# Altium schematic sheet ETH_CAN_Sheet1.SchDoc
size A2
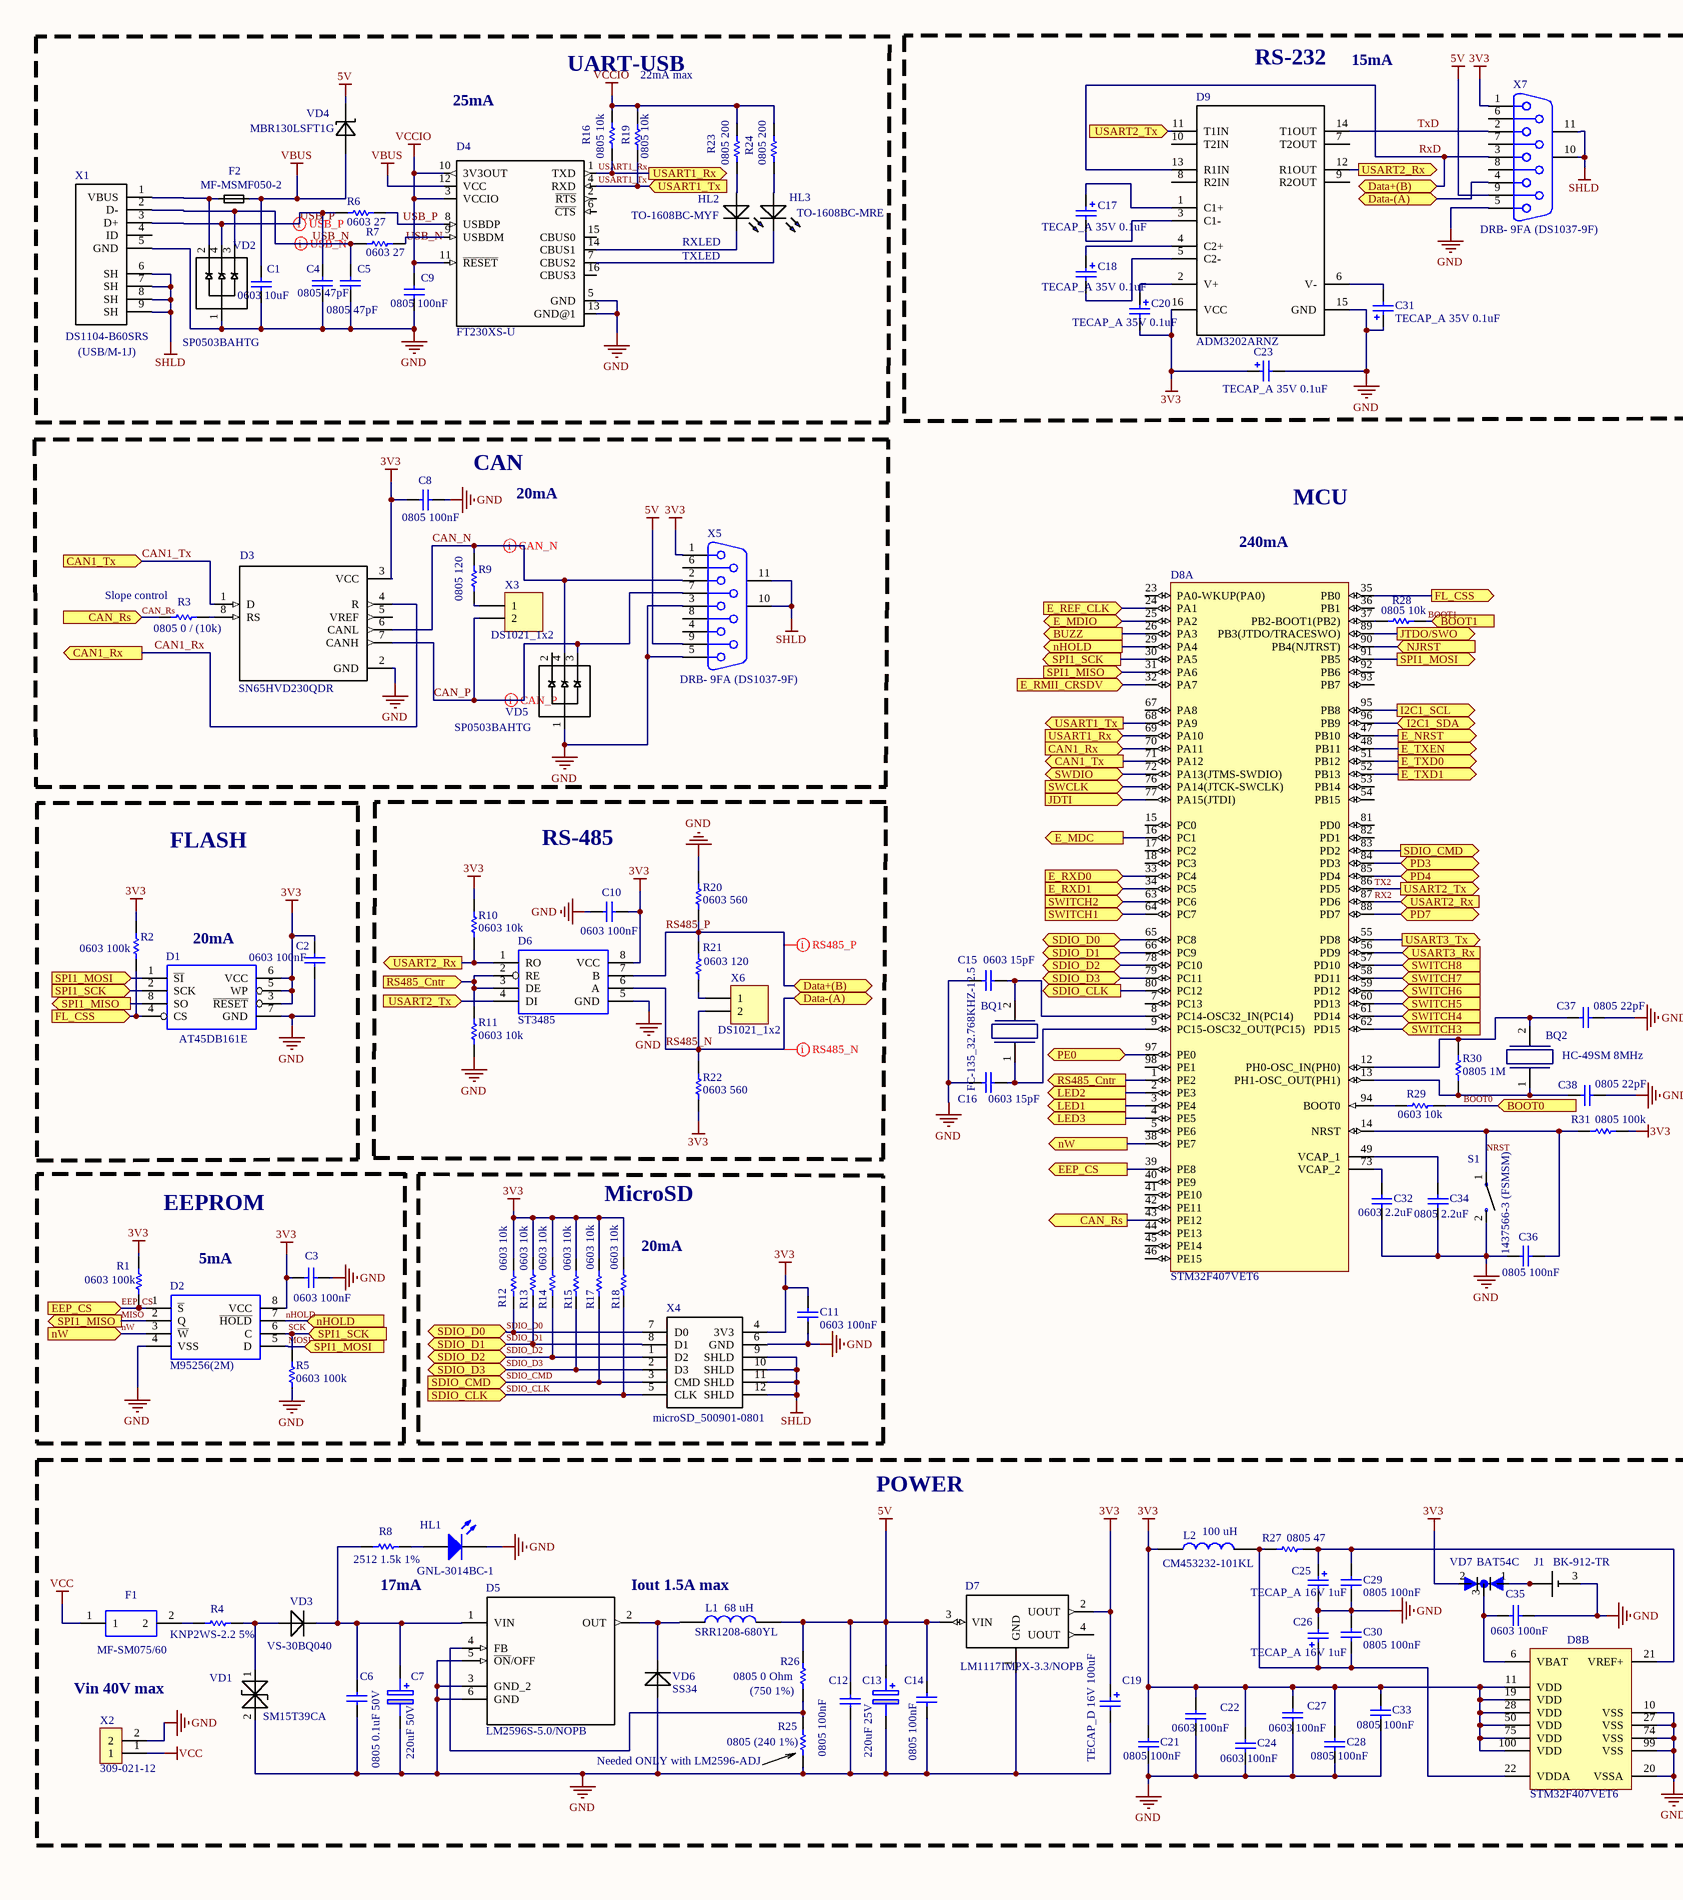
[diagram p0: ETH_CAN_Sheet1.SchDoc, left]
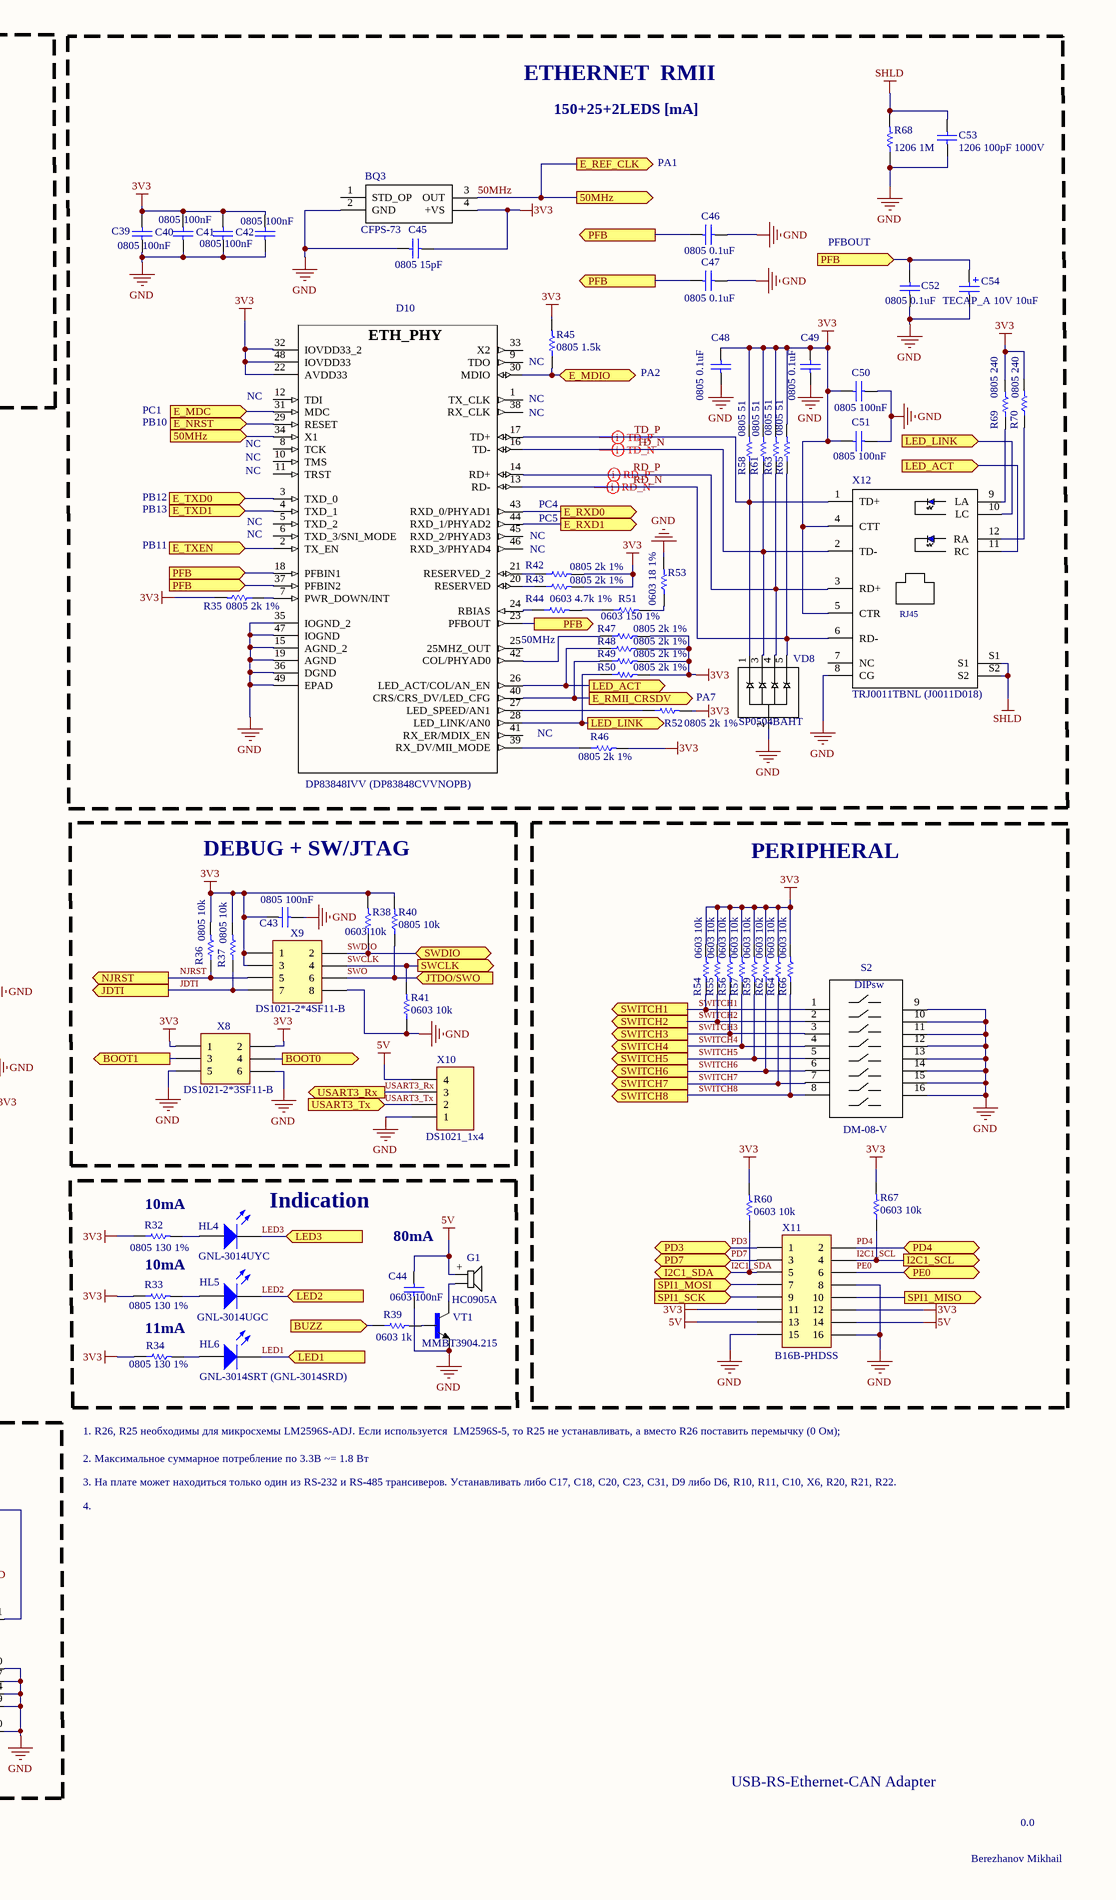
[diagram p1: ETH_CAN_Sheet1.SchDoc, right]

## Parts
BQ1  FC-135_32.768KHZ-12.5  [FC-135]
BQ2  HC-49SM 8MHz  [HC49SM]
BQ3  CFPS-73  [CFPS-73]
C1  0603 10uF  [C_SMD0603]
C2  0603 100nF  [C_SMD0603]
C3  0603 100nF  [C_SMD0603]
C4  0805 47pF  [C_SMD0805]
C5  0805 47pF  [C_SMD0805]
C6  0805 0.1uF 50V  [C_SMD0805]
C7  220uF 50V  [SMD_ELC_CAP]
C8  0805 100nF  [C_SMD0805]
C9  0805 100nF  [C_SMD0805]
C10  0603 100nF  [C_SMD0603]
C11  0603 100nF  [C_SMD0603]
C12  0805 100nF  [C_SMD0805]
C13  220uF 25V  [SMD_ELC_CAP]
C14  0805 100nF  [C_SMD0805]
C15  0603 15pF  [C_SMD0603]
C16  0603 15pF  [C_SMD0603]
C17  TECAP_A 35V 0.1uF  [TECAP_A]
C18  TECAP_A 35V 0.1uF  [TECAP_A]
C19  TECAP_D 16V 100uF  [TECAP_D]
C20  TECAP_A 35V 0.1uF  [TECAP_A]
C21  0805 100nF  [C_SMD0805]
C22  0603 100nF  [C_SMD0603]
C23  TECAP_A 35V 0.1uF  [TECAP_A]
C24  0603 100nF  [C_SMD0603]
C25  TECAP_A 16V 1uF  [TECAP_A]
C26  TECAP_A 16V 1uF  [TECAP_A]
C27  0603 100nF  [C_SMD0603]
C28  0805 100nF  [C_SMD0805]
C29  0805 100nF  [C_SMD0805]
C30  0805 100nF  [C_SMD0805]
C31  TECAP_A 35V 0.1uF  [TECAP_A]
C32  0603 2.2uF  [C_SMD0603]
C33  0805 100nF  [C_SMD0805]
C34  0805 2.2uF  [C_SMD0805]
C35  0603 100nF  [C_SMD0603]
C36  0805 100nF  [C_SMD0805]
C37  0805 22pF  [C_SMD0805]
C38  0805 22pF  [C_SMD0805]
C39  0805 100nF  [C_SMD0805]
C40  0805 100nF  [C_SMD0805]
C41  0805 100nF  [C_SMD0805]
C42  0805 100nF  [C_SMD0805]
C43  0805 100nF  [C_SMD0805]
C44  0603 100nF  [C_SMD0603]
C45  0805 15pF  [C_SMD0805]
C46  0805 0.1uF  [C_SMD0805]
C47  0805 0.1uF  [C_SMD0805]
C48  0805 0.1uF  [C_SMD0805]
C49  0805 0.1uF  [C_SMD0805]
C50  0805 100nF  [C_SMD0805]
C51  0805 100nF  [C_SMD0805]
C52  0805 0.1uF  [C_SMD0805]
C53  1206 100pF 1000V  [CAP SMD1206]
C54  TECAP_A 10V 10uF  [TECAP_A]
D1  AT45DB161E  [SOIC8(5.3mm)]
D2  M95256(2M)  [SOIC8 (SO-8)]
D3  SN65HVD230QDR  [SOIC-12]
D4  FT230XS-U  [SSOP16]
D5  LM2596S-5.0/NOPB  [TO263-5]
D6  ST3485  [SOIC8 (SO-8)]
D7  LM1117IMPX-3.3/NOPB  [SOT223]
D8  STM32F407VET6  [STM-LQFP100_N]  (parts A,B of 2)
D9  ADM3202ARNZ  [SOIC-16]
D10  DP83848IVV (DP83848CVVNOPB)  [QFP48]
F1  MF-SM075/60  [MF-SM075/60]
F2  MF-MSMF050-2  [FUSE1812x0]
G1  HC0905A  [HC090xA]
HL1  GNL-3014BC-1  [LED3mm]
HL2  TO-1608BC-MYF  [LED_SMD1608GREEN]
HL3  TO-1608BC-MRE  [LED_SMD1608]
HL4  GNL-3014UYC  [LED3mm]
HL5  GNL-3014UGC  [LED3mm]
HL6  GNL-3014SRT (GNL-3014SRD)  [LED3mm]
J1  BK-912-TR  [BK-912-TR]
L1  SRR1208-680YL  [SRR1208]
L2  CM453232-101KL  [CM453232-101KL]
R1  0603 100k  [R_SMD0603]
R2  0603 100k  [R_SMD0603]
R3  0805 0 / (10k)  [R_SMD0805]
R4  KNP2WS-2.2 5%  [KNP2WS]
R5  0603 100k  [R_SMD0603]
R6  0603 27  [R_SMD0603]
R7  0603 27  [R_SMD0603]
R8  2512 1.5k 1%  [R_SMD2512]
R9  0805 120  [R_SMD0805]
R10  0603 10k  [R_SMD0603]
R11  0603 10k  [R_SMD0603]
R12  0603 10k  [R_SMD0603]
R13  0603 10k  [R_SMD0603]
R14  0603 10k  [R_SMD0603]
R15  0603 10k  [R_SMD0603]
R16  0805 10k  [R_SMD0805]
R17  0603 10k  [R_SMD0603]
R18  0603 10k  [R_SMD0603]
R19  0805 10k  [R_SMD0805]
R20  0603 560  [R_SMD0603]
R21  0603 120  [R_SMD0603]
R22  0603 560  [R_SMD0603]
R23  0805 200  [R_SMD0805]
R24  0805 200  [R_SMD0805]
R25  0805 (240 1%)  [R_SMD0805]
R26  0805 0 Ohm  [C_SMD0805]
R27  0805 47  [R_SMD0805]
R28  0805 10k  [R_SMD0805]
R29  0603 10k  [R_SMD0603]
R30  0805 1M  [R_SMD0805]
R31  0805 100k  [C_SMD0805]
R32  0805 130 1%  [R_SMD0805]
R33  0805 130 1%  [R_SMD0805]
R34  0805 130 1%  [R_SMD0805]
R35  0805 2k 1%  [R_SMD0805]
R36  0805 10k  [R_SMD0805]
R37  0805 10k  [R_SMD0805]
R38  0603 10k  [R_SMD0603]
R39  0603 1k  [R_SMD0603]
R40  0805 10k  [R_SMD0805]
R41  0603 10k  [R_SMD0603]
R42  0805 2k 1%  [R_SMD0805]
R43  0805 2k 1%  [R_SMD0805]
R44  0603 4.7k 1%  [R_SMD0603]
R45  0805 1.5k  [R_SMD0805]
R46  0805 2k 1%  [R_SMD0805]
R47  0805 2k 1%  [R_SMD0805]
R48  0805 2k 1%  [R_SMD0805]
R49  0805 2k 1%  [R_SMD0805]
R50  0805 2k 1%  [R_SMD0805]
R51  0603 150 1%  [R_SMD0603]
R52  0805 2k 1%  [R_SMD0805]
R53  0603 18 1%  [R_SMD0603]
R54  0603 10k  [R_SMD0603]
R55  0603 10k  [R_SMD0603]
R56  0603 10k  [R_SMD0603]
R57  0603 10k  [R_SMD0603]
R58  0805 51  [R_SMD0805]
R59  0603 10k  [R_SMD0603]
R60  0603 10k  [R_SMD0603]
R61  0805 51  [R_SMD0805]
R62  0603 10k  [R_SMD0603]
R63  0805 51  [R_SMD0805]
R64  0603 10k  [R_SMD0603]
R65  0805 51  [R_SMD0805]
R66  0603 10k  [R_SMD0603]
R67  0603 10k  [R_SMD0603]
R68  1206 1M  [R_SMD1206]
R69  0805 240  [R_SMD0805]
R70  0805 240  [R_SMD0805]
S1  1437566-3 (FSMSM)  [1437566-3]  (value not drawn)
S2  DM-08-V  [DM-08-V]
VD1  SM15T39CA  [DO214AB SMC]
VD2  SP0503BAHTG  [SP0503BAHTG]
VD3  VS-30BQ040  [DO214AB SMC]
VD4  MBR130LSFT1G  [SOD-123FL]
VD5  SP0503BAHTG  [SP0503BAHTG]
VD6  SS34  [DO214AB SMC]
VD7  BAT54C  [BAT54C_SOT23-3]
VD8  SP0504BAHT  [SOT23-5]
VT1  MMBT3904.215  [SOT23]
X1  DS1104-B60SRS  [MUSB-05-S-B-SM]
X2  309-021-12  [390-021-12]
X3  DS1021_1x2  [PLD2]
X4  microSD_500901-0801  [5009001-0801]
X5  DRB- 9FA (DS1037-9F)  [DRB- 9FA]
X6  DS1021_1x2  [PLD2]
X7  DRB- 9FA (DS1037-9F)  [DRB- 9FA]
X8  DS1021-2*3SF11-B  [PLD2-3]
X9  DS1021-2*4SF11-B  [PLD2-4]
X10  DS1021_1x4  [PLD1X4]
X11  B16B-PHDSS  [PHD16]
X12  TRJ0011TBNL (J0011D018)  [J0011D018]

## Blocks framed on the sheet
UART-USB: C1 C4 C5 C9 D4 F2 HL2 HL3 R6 R7 R16 R19 R23 R24 VD2 VD4 X1
RS-232: C17 C18 C20 C23 C31 D9 X7
ETHERNET  RMII: BQ3 C39-C42 C45-C54 D10 R35 R42-R53 R58 R61 R63 R65 R68-R70 VD8 X12
CAN: C8 D3 R3 R9 VD5 X3 X5
FLASH: C2 D1 R2
RS-485: C10 D6 R10 R11 R20-R22 X6
DEBUG + SW/JTAG: C43 R36-R38 R40 R41 X8-X10
PERIPHERAL: R54-R57 R59 R60 R62 R64 R66 R67 S2 X11
MicroSD: C11 R12-R15 R17 R18 X4
Indication: C44 G1 HL4-HL6 R32-R34 R39 VT1
POWER: C6 C7 C12-C14 C19 C21 C22 C24-C30 C33 C35 D5 D7 D8 F1 HL1 J1 L1 L2 R4 R8 R25-R27 VD1 VD3 VD6 VD7 X2

## Ports
50MHz (in), 50MHz (out), BOOT0 (in), BOOT0 (out), BOOT1 (in), BOOT1 (out), BUZZ (in), BUZZ (out), CAN1_Rx (in), CAN1_Rx (out), CAN1_Tx (in), CAN1_Tx (out), CAN_Rs (in), CAN_Rs (out), Data+(B) (bidir), Data-(A) (bidir), E_MDC (in), E_MDC (out), E_MDIO (bidir), E_NRST (in), E_NRST (out), E_REF_CLK (in), E_REF_CLK (out), E_RMII_CRSDV (in), E_RMII_CRSDV (out), E_RXD0 (in), E_RXD0 (out), E_RXD1 (in), E_RXD1 (out), E_TXD0 (in), E_TXD0 (out), E_TXD1 (in), E_TXD1 (out), E_TXEN (in), E_TXEN (out), EEP_CS (in), EEP_CS (out), FL_CSS (in), FL_CSS (out), I2C1_SCL (out), I2C1_SDA (bidir), JDTI (in), JDTI (out), JTDO/SWO (in), JTDO/SWO (out), LED1 (in), LED1 (out), LED2 (in), LED2 (out), LED3 (in), LED3 (out), LED_ACT (in), LED_ACT (out), LED_LINK (in), LED_LINK (out), nHOLD (in), nHOLD (out), NJRST (in), NJRST (out), nW (in), nW (out), PD3 (bidir), PD4 (bidir), PD7 (bidir), PE0 (bidir), PFB (in), PFB (out), RS485_Cntr (in), RS485_Cntr (out), SDIO_CLK (in), SDIO_CLK (out), SDIO_CMD (in), SDIO_CMD (out), SDIO_D0 (bidir), SDIO_D1 (bidir), SDIO_D2 (bidir), SDIO_D3 (bidir), SPI1_MISO (in), SPI1_MISO (out), SPI1_MOSI (in), SPI1_MOSI (out), SPI1_SCK (in), SPI1_SCK (out), SWCLK (in), SWCLK (out), SWDIO (bidir), SWITCH1 (in), SWITCH1 (out), SWITCH2 (in), SWITCH2 (out), SWITCH3 (in), SWITCH3 (out), SWITCH4 (in), SWITCH4 (out), SWITCH5 (in), SWITCH5 (out), SWITCH6 (in), SWITCH6 (out), SWITCH7 (in), SWITCH7 (out), SWITCH8 (in), SWITCH8 (out), USART1_Rx (in), USART1_Rx (out), USART1_Tx (in), USART1_Tx (out), USART2_Rx (in), USART2_Rx (out), USART2_Tx (in), USART2_Tx (out), USART3_Rx (in), USART3_Rx (out), USART3_Tx (in), USART3_Tx (out)

## Nets
3V3: BQ3.4(+VS) C2.2 C3.1 C8.2 C10.1 C11.1 C19.1 C20.2 C21.2 C22.2 C23.1 C24.2 C27.2 C28.2 C33.2 C39.1 C40.1 C41.1 C42.1 C43.2 C45.2 C48.2 C49.2 C50.1 C51.1 D1.3(~{RESET}) D1.5(WP) D1.6(VCC) D2.8(VCC) D3.3(VCC) D6.8(VCC) D7.2(UOUT) D8.11(VDD) D8.19(VDD) D8.28(VDD) D8.50(VDD) D8.75(VDD) D8.100(VDD) D9.16(VCC) D10.22(AVDD33) D10.32(IOVDD33_2) D10.48(IOVDD33) L2.1 R1.2 R2.2 R10.2 R12.2 R13.2 R14.2 R15.2 R17.2 R18.2 R22.1 R31.2 R32.1 R33.1 R34.1 R35.2 R36.2 R37.2 R38.2 R40.2 R42.2 R43.2 R45.2 R46.2 R47.2 R48.2 R49.2 R50.2 R52.2 R54.2 R55.2 R56.2 R57.2 R58.2 R59.2 R60.2 R61.2 R62.2 R63.2 R64.2 R65.2 R66.2 R67.2 R69.2 R70.2 VD7.2(A2) X4.4(3V3) X5.1 X7.1 X8.1 X8.2 X9.1 X9.3 X11.11 X11.12 X12.4(CTT) X12.5(CTR)
5V: C12.2 C13.1(+) C14.2 C44.2 D7.3(VIN) G1.+ L1.2 R26.2 VD4.C X5.9 X7.9 X10.4 X11.13 X11.14
GND: BQ3.2(GND) C1.1 C2.1 C3.2 C4.1 C5.1 C6.1 C7.2(-) C8.1 C9.1 C10.2 C11.2 C12.1 C13.2(-) C14.1 C15.2 C16.2 C19.2 C21.1 C22.1 C23.2 C24.1 C25.2 C26.2 C27.1 C28.1 C29.1 C30.2 C31.1 C32.1 C33.1 C34.1 C35.1 C36.2 C37.1 C38.2 C39.2 C40.2 C41.2 C42.2 C43.1 C44.1 C45.1 C46.2 C47.2 C48.1 C49.1 C50.2 C51.2 C52.2 C53.1 C54.2 D1.7(GND) D2.4(VSS) D3.2(GND) D4.5(GND) D4.13(GND@1) D5.3(GND_2) D5.5(~{ON}/OFF) D5.6(GND) D6.5(GND) D7.1(GND) D8.10(VSS) D8.20(VSSA) D8.27(VSS) D8.74(VSS) D8.99(VSS) D9.15(GND) D10.15(AGND_2) D10.19(AGND) D10.35(IOGND_2) D10.36(DGND) D10.47(IOGND) D10.49(EPAD) HL1.2(K) J1.3(NEG) R5.1 R11.1 R20.2 R25.1 R41.1 R53.2 R68.1 S1.2 S2.9 S2.10 S2.11 S2.12 S2.13 S2.14 S2.15 S2.16 VD1.2(K) VD2.1(GND) VD5.1(GND) VD6.1(POS) VD8.2(GND) VT1.E X1.5(GND) X2.2 X4.6(GND) X5.3 X5.5 X7.5 X8.5 X8.6 X9.8 X10.1 X11.8 X11.15 X11.16 X12.8(CG)
SHLD: C53.2 R68.2 X1.6(SH) X1.7(SH) X1.8(SH) X1.9(SH) X4.9(SHLD) X4.10(SHLD) X4.11(SHLD) X4.12(SHLD) X5.10(MH1) X5.11(MH2) X7.10(MH1) X7.11(MH2) X12.S1 X12.S2
VBUS: C1.2 D4.12(VCC) F2.2 VD4.A
VCC: F1.1 X2.1
VCCIO: C9.2 D4.3(VCCIO) D4.10(3V3OUT) D4.11(~{RESET}) R16.2 R19.2 R23.1 R24.1
50MHz: BQ3.3(OUT) D8.24(PA1) D10.34(X1) ; port 50MHz, port E_REF_CLK
BOOT0: R29.2 X8.4 ; port BOOT0
BOOT1: R28.2 X8.3 ; port BOOT1
BUZZ: D8.26(PA3) R39.1 ; port BUZZ
CAN1_Rx: D3.4(R) D8.70(PA11) ; port CAN1_Rx
CAN1_Tx: D3.1(D) D8.71(PA12) ; port CAN1_Tx
CAN_N: D3.6(CANL) R9.1 VD5.4(C) X5.2
CAN_P: D3.7(CANH) VD5.3(B) X3.2 X5.7
CAN_Rs: D8.43(PE12) R3.2 ; port CAN_Rs
E_MDC: D8.16(PC1) D10.31(MDC) ; port E_MDC
E_MDIO: D8.25(PA2) D10.30(MDIO) R45.1 ; port E_MDIO
E_NRST: D8.47(PB10) D10.29(RESET) ; port E_NRST
E_RMII_CRSDV: D8.32(PA7) D10.40(CRS/CRS_DV/LED_CFG) R49.1 ; port E_RMII_CRSDV
E_RXD0: D8.33(PC4) D10.43(RXD_0/PHYAD1) ; port E_RXD0
E_RXD1: D8.34(PC5) D10.44(RXD_1/PHYAD2) ; port E_RXD1
E_TXD0: D8.51(PB12) D10.3(TXD_0) ; port E_TXD0
E_TXD1: D8.52(PB13) D10.4(TXD_1) ; port E_TXD1
E_TXEN: D8.48(PB11) D10.2(TX_EN) ; port E_TXEN
EEP_CS: D2.1(~{S}) D8.39(PE8) R1.1 ; port EEP_CS
FL_CSS: D1.4(CS) D8.35(PB0) R2.1 ; port FL_CSS
I2C1_SCL: D8.95(PB8) R67.1 X11.4 ; port I2C1_SCL
I2C1_SDA: D8.96(PB9) R60.1 X11.5 ; port I2C1_SDA
JDTI: D8.77(PA15(JTDI)) R37.1 X9.7 ; port JDTI
LED1: D8.3(PE4) HL6.2(K) ; port LED1
LED2: D8.2(PE3) HL5.2(K) ; port LED2
LED3: D8.4(PE5) HL4.2(K) ; port LED3
LED_ACT: D10.26(LED_ACT/COL/AN_EN) R48.1 X12.11(RC) ; port LED_ACT
LED_LINK: D10.28(LED_LINK/AN0) R50.1 X12.10(LC) ; port LED_LINK
MISO: D1.8(SO) D2.2(Q) D8.31(PA6) X11.10 ; port SPI1_MISO
MOSI: D1.1(~{SI}) D2.5(D) D8.91(PB5) X11.7 ; port SPI1_MOSI
nHOLD: D2.7(~{HOLD}) D8.29(PA4) ; port nHOLD
NJRST: D8.90(PB4(NJTRST)) R36.1 X9.5 ; port NJRST
NRST: C36.1 D8.14(NRST) R31.1 S1.1
nW: D2.3(~{W}) D8.38(PE7) ; port nW
PD3: D8.84(PD3) X11.1 ; port PD3
PD4: D8.85(PD4) X11.2 ; port PD4
PD7: D8.88(PD7) X11.3 ; port PD7
PE0: D8.97(PE0) X11.6 ; port PE0
PFB: C46.1 C47.1 C52.1 C54.1 D10.18(PFBIN1) D10.23(PFBOUT) D10.37(PFBIN2) ; port PFB
RD_N: D10.13(RD-) R65.1 VD8.5(D) X12.6(RD-)
RD_P: D10.14(RD+) R63.1 VD8.4(B) X12.3(RD+)
RS485_Cntr: D6.2(RE) D6.3(DE) D8.1(PE2) R11.2 ; port RS485_Cntr
RS485_N: D6.6(A) R22.2 X6.2 X7.4 ; port Data-(A)
RS485_P: D6.7(B) D9.13(R1IN) R20.1 R21.2 X7.3 ; port Data+(B)  [also labelled RxD]
RX2: D6.1(RO) D8.87(PD6) D9.12(R1OUT) R10.1 ; port USART2_Rx
SCK: D1.2(SCK) D2.6(C) D8.30(PA5) R5.2 X11.9 ; port SPI1_SCK
SDIO_CLK: D8.80(PC12) R18.1 X4.5(CLK) ; port SDIO_CLK
SDIO_CMD: D8.83(PD2) R17.1 X4.3(CMD) ; port SDIO_CMD
SDIO_D0: D8.65(PC8) R12.1 X4.7(D0) ; port SDIO_D0
SDIO_D1: D8.66(PC9) R13.1 X4.8(D1) ; port SDIO_D1
SDIO_D2: D8.78(PC10) R14.1 X4.1(D2) ; port SDIO_D2
SDIO_D3: D8.79(PC11) R15.1 X4.2(D3) ; port SDIO_D3
SWCLK: D8.76(PA14(JTCK-SWCLK)) R41.2 X9.4 ; port SWCLK
SWDIO: D8.72(PA13(JTMS-SWDIO)) R38.1 X9.2 ; port SWDIO
SWITCH1: D8.64(PC7) R54.1 S2.1 ; port SWITCH1
SWITCH2: D8.63(PC6) R55.1 S2.2 ; port SWITCH2
SWITCH3: D8.62(PD15) R56.1 S2.3 ; port SWITCH3
SWITCH4: D8.61(PD14) R57.1 S2.4 ; port SWITCH4
SWITCH5: D8.60(PD13) R59.1 S2.5 ; port SWITCH5
SWITCH6: D8.59(PD12) R62.1 S2.6 ; port SWITCH6
SWITCH7: D8.58(PD11) R64.1 S2.7 ; port SWITCH7
SWITCH8: D8.57(PD10) R66.1 S2.8 ; port SWITCH8
SWO: D8.89(PB3(JTDO/TRACESWO)) R40.1 X9.6 ; port JTDO/SWO
TD_N: D10.16(TD-) R61.1 VD8.3(C) X12.2(TD-)
TD_P: D10.17(TD+) R58.1 VD8.1(A) X12.1(TD+)
TX2: D6.4(DI) D8.86(PD5) D9.11(T1IN) ; port USART2_Tx
TxD: D9.14(T1OUT) X7.2
USART1_Rx: D4.1(TXD) D8.69(PA10) R16.1 ; port USART1_Rx
USART1_Tx: D4.4(RXD) D8.68(PA9) R19.1 ; port USART1_Tx
USART3_Rx: D8.56(PD9) X10.3 ; port USART3_Rx
USART3_Tx: D8.55(PD8) X10.2 ; port USART3_Tx
USB_N: C5.2 D4.9(USBDM) R7.1 R7.2 VD2.3(B) X1.2(D-)
USB_P: C4.2 D4.8(USBDP) R6.1 R6.2 VD2.4(C) X1.3(D+)
NetBQ1_1: BQ1.1 C16.1 D8.9(PC15-OSC32_OUT(PC15))
NetBQ1_2: BQ1.2 C15.1 D8.8(PC14-OSC32_IN(PC14))
NetBQ2_1: BQ2.1 C38.1 D8.13(PH1-OSC_OUT(PH1)) R30.1
NetBQ2_2: BQ2.2 C37.2 D8.12(PH0-OSC_IN(PH0)) R30.2
NetC6_2: C6.2 C7.1(+) D5.1(VIN) R8.1 VD3.2(NEG)
NetC17_1: C17.1 D9.1(C1+)
NetC17_2: C17.2 D9.3(C1-)
NetC18_1: C18.1 D9.4(C2+)
NetC18_2: C18.2 D9.5(C2-)
NetC20_1: C20.1 D9.2(V+)
NetC25_1: C25.1 C29.2 D8.21(VREF+) R27.2
NetC26_1: C26.1 C30.1 D8.22(VDDA) L2.2 R27.1
NetC31_2: C31.2 D9.6(V-)
NetC32_2: C32.2 D8.73(VCAP_2)
NetC34_2: C34.2 D8.49(VCAP_1)
NetC35_2: C35.2 D8.6(VBAT) VD7.3(C)
NetD3_8: D3.8(RS) R3.1
NetD4_7: D4.7(CBUS2) HL3.2(NEG)
NetD4_14: D4.14(CBUS1) HL2.2(NEG)
NetD5_2: D5.2(OUT) L1.1 VD6.2(NEG)
NetD5_4: D5.4(FB) R25.2 R26.1
NetD8_37: D8.37(PB2-BOOT1(PB2)) R28.1
NetD8_94: D8.94(BOOT0) R29.1
NetD10_7: D10.7(PWR_DOWN/INT) R35.1
NetD10_20: D10.20(RESERVED) R43.1
NetD10_21: D10.21(RESERVED_2) R42.1
NetD10_24: D10.24(RBIAS) R44.1
NetD10_27: D10.27(LED_SPEED/AN1) R52.1
NetD10_39: D10.39(RX_DV/MII_MODE) R46.1
NetD10_42: D10.42(COL/PHYAD0) R47.1
NetF1_2: F1.2 R4.1
NetF2_1: F2.1 VD2.2(A) X1.1(VBUS)
NetG1_2: G1.2 VT1.C
NetHL1_1: HL1.1(A) R8.2
NetHL2_1: HL2.1(POS) R23.2
NetHL3_1: HL3.1(POS) R24.2
NetHL4_1: HL4.1(A) R32.2
NetHL5_1: HL5.1(A) R33.2
NetHL6_1: HL6.1(A) R34.2
NetJ1_1: J1.1(POS) J1.2(POS) VD7.1(A1)
NetR4_2: R4.2 VD1.1(A) VD3.1(POS)
NetR9_2: R9.2 X3.1
NetR21_1: R21.1 X6.1
NetR39_2: R39.2 VT1.B
NetR44_2: R44.2 R51.1
NetR51_2: R51.2 R53.1
NetR69_1: R69.1 X12.9(LA)
NetR70_1: R70.1 X12.12(RA)

Not connected (* = marked no-connect by the designer): BQ3 1(STD_OP); D3 5(VREF); D4 2(~{RTS}) 6(~{CTS}) 15(CBUS0) 16(CBUS3); D7 4(UOUT); D8 5(PE6) 7(PC13) 15(PC0) 17(PC2) 18(PC3) 23(PA0-WKUP(PA0)) 36(PB1) 40(PE9) 41(PE10) 42(PE11) 44(PE13) 45(PE14) 46(PE15) 53(PB14) 54(PB15) 67(PA8) 81(PD0) 82(PD1) 92(PB6) 93(PB7) 98(PE1); D9 7(T2OUT) 8(R2IN) 9(R2OUT) 10(T2IN); D10 1(TX_CLK) 5(TXD_2) 6(TXD_3/SNI_MODE) 8(TCK) 9(TDO) 10(TMS) 11(TRST) 12(TDI) 25(25MHZ_OUT) 33(X2) 38(RX_CLK) 41(RX_ER/MDIX_EN) 45(RXD_2/PHYAD3) 46(RXD_3/PHYAD4); VD5 2(A); X1 4(ID); X5 4 6 8; X7 6 7 8; X12 7(NC)

## Layout directives
differential pair: CAN_N, CAN_P, RD_N, RD_P, RS485_N, RS485_P, TD_N, TD_P, USB_N, USB_P

## Notes on the sheet
- 15mА
- 25mА
- 22mA max
- 150+25+2LEDS [mА]
- PA1
- (near HL2) RXLED
- PFBOUT
- (near HL2) TXLED
- (near X1) (USB/M-1J)
- (near R45) NC
- PA2
- PC1
- PB10
- (near D10) NC
- NC
- 20mА
- MCU
- PB12
- (near D8) 240mА
- PB13
- PB11
- PC4
- PC5
- (near R3) Slope control
- 50MHz
- (near R52) PA7
- (near D1) 20mА
- EEPROM
- 5mА
- (near R18) 20mА
- (near C36) 1437566-3 (FSMSM)
- (near R32) 10mА
- 80mА
- 10mА
- 11mА
- 1. R26, R25 необходимы для микросхемы LM2596S-ADJ. Если используется  LM2596S-5, то R25 не устанавливать, а вместо R26 поставить перемычку (0 Ом);
- 2. Максимальное суммарное потребление по 3.3В ~= 1.8 Вт
- 3. На плате может находиться только один из RS-232 и RS-485 трансиверов. Устанавливать либо С17, С18, C20, С23, С31, D9 либо D6, R10, R11, C10, X6, R20, R21, R22.
- 17mА
- Iout 1.5А max
- (near L2) 100 uH
- 4.
- (near L1) 68 uH
- Vin 40V max
- (near R26) (750 1%)
- Needed ONLY with LM2596-ADJ
- USB-RS-Ethernet-CAN Adapter
- Berezhanov Mikhail
- 0.0
- (in symbol DM-08-V) DIPsw
- (in symbol DP83848CVVNOPB) ETH_PHY
- (in symbol RJ45 J0011D018) RJ45

## Library data of the parts
BQ1 = FC135-32768-7: Clock SMD Crystal
BQ2 = HC49SM
BQ3 = SPXO018044CFPS-73: IQD FREQUENCY PRODUCTS - SPXO018044-CFPS-73 - OSCILLATOR FREQUENCY, 50MHZ
C1-C3 C10 C11 C15 C16 C22 C24 C27 C32 C35 C44 = C0603: SMD Cap 0603
C4-C6 C8 C9 C12 C21 C28-C30 C33 C34 C36-C43 C45-C52 = C0805: SMD Cap 0805; Note: Footprint corresponds to dimensions for bulk cassette packaging. This case size has tightened tolerances.; Published: 17-Jul-2002; LatestRevisionDate: 19-Mar-2004; LatestRevisionNote: Silkscreen size reduced.; DatasheetDocument: Mar-2001; PackageDocument: Mar-2001; PackageReference: 0805; Publisher: Altium Limited; Code_JEITA: 0805; Code_IPC: 2012[0805]; ComponentLink1Description: Manufacturer Link; ComponentLink1URL: http://www.kemet.com/; ComponentLink2Description: Datasheet; ComponentLink2URL: http://www.kemet.com/kemet/web/homepage/kechome.nsf/vapubfilesname/F3102TA.pdf/$file/F3102TA.pdf
C7 C13 = EEEFK1H221P: Ecap 220uF 50V G case Panasonic Aluminium Electrolytic Capacitor 220F 50 V dc 10mm Surface Mount series FK SMD lifetime 2000h; Allied_Number: 70256552; Manufacturer_Name: Panasonic; Manufacturer_Part_Number: EEEFK1H221P; RS Part Number: 6294598; RS Price/Stock: http://uk.rs-online.com/web/p/products/6294598; Allied Price/Stock: https://www.alliedelec.com/panasonic-eee-fk1h221p/70256552/; Arrow Part Number: EEEFK1H221P; Arrow Price/Stock: https://www.arrow.com/en/products/eeefk1h221p/panasonic; Datasheet Link: https://industrial.panasonic.com/cdbs/www-data/pdf/RDE0000/ABA0000C1181.pdf
C14 = C0805: SMD Cap 0805
C17 C18 C20 C23 C25 C26 C31 C54 = TECAP_A: Tantalum pol cap type A
C19 = TECAP_D: Tantalum pol cap type D
C53 = C1206: SMD Cap 1206; Published: 17-Jul-2002; LatestRevisionDate: 19-Mar-2004; LatestRevisionNote: Silkscreen size reduced.; DatasheetDocument: Mar-2001; PackageDocument: Mar-2001; PackageReference: 1206; Publisher: Altium Limited; Code_JEITA: 1206; Code_IPC: 3216 [1206]; ComponentLink1Description: Manufacturer Link; ComponentLink1URL: http://www.kemet.com/; ComponentLink2Description: Datasheet; ComponentLink2URL: http://www.kemet.com/kemet/web/homepage/kechome.nsf/vapubfilesname/F3102TA.pdf/$file/F3102TA.pdf
D1 = AT45DB161E: SPI FLASH 16Mbit(528 bytes x 4096 pages)
D2 = M95256(2M)-WMN6TP: M95256-WMN6TP, Serial EEPROM Memory 256kbit, Serial-SPI, 60ns 2.5  5.5 V, 8-Pin SOIC
D3 = SN65HVD230QDR: 3.3-V CAN Transceiver with Standby Mode 8-SOIC -40 to 125; MF: Texas Instruments; Availability: Good; Package: SOIC-8 Texas Instruments; MP: SN65HVD230QDR; Price: 1.73 USD; SnapEDA_Link: https://www.snapeda.com/parts/SN65HVD230QDR/Texas%20Instruments/view-part/?ref=snap; Value: *
D4 = FT230XS-U: FT230XS-U, USB Controller, 3MBd, USB 1.1, USB 2.0, 5 V, 16-Pin SSOP; MF: FTDI,; Availability: Unavailable; Price: None; SnapEDA_Link: https://www.snapeda.com/parts/FT230XS-U/FTDI%2C%20Future%20Technology%20Devices%20International%20Ltd/view-part/?ref=snap; Package: SSOP-16 FTDI,; MP: FT230XS-U; Value: *
D5 = LM2596S: SIMPLE SWITCHER&#174; 4.5V to 40V, 3A Low Component Count Step-Down Regulator
D6 = ST3485: 3.3 V low power transceiver for RS-485
D7 = LM1117-3.3: Линейный регулятор с низким падением напряжения, 3.3В
D8 = STM32F407VET6: ARM Cortex-M4 32-bit MCU+FPU, 210 DMIPS, 512 kB Flash, 192 kB Internal RAM, 82 I/Os, 100-pin LQFP, -40 to 85 degC, Tray; Manufacturer: STMicroelectronics; D/A Converter: 2x12-bit; FLASH Size (Prog) (kB): 512; I/Os (High Current): 82; Internal RAM Size (kB): 192; Operating Frequency(F) (Processor speed) (MHz): 168; Supply Voltage(Vcc) max (V): 3.6; Supply Voltage(Vcc) min (V): 1.8; DatasheetVersion: Rev. 4; PackageVersion: Rev. 1, 06/2013; PackageReference: LQFP100; PackageDescription: 100-Pin Low Profile Quad Flat Package, 14 x 14 mm Body, 0.5 mm Pitch; Supplier 1: Digi-Key; Supplier Part Number 1: 497-12075-ND; Supplier 2: Farnell; Supplier Part Number 2: 2064367; Supplier 3: Newark; Supplier Part Number 3: 73T2332; Supplier 4: Mouser; Supplier Part Number 4: 511-STM32F407VET6; Core: ARM Cortex-M4; Packing: Tray; Mounting Technology: Surface Mount; PartNumber: STM32F407VET6; ComponentLink1Description: Manufacturer URL; ComponentLink1URL: http://www.st.com/web/en/home.html; ComponentLink2Description: Datasheet; ComponentLink2URL: http://www.st.com/st-web-ui/static/active/en/resource/technical/document/datasheet/DM00037051.pdf; ComponentLink3Description: Package Specification; ComponentLink3URL: http://www.st.com/st-web-ui/static/active/en/resource/technical/document/data_brief/DM00071938.pdf
D9 = ADM3202ARNZ: 3.3V SMD RS232-UART
D10 = DP83848CVVNOPB: ETH Transciever
F1 = MF-SM075/60: Resettable Fuse PTC 0.75A(hold) 1.5A(trip) 60V 10A 1.7W 0.3s 0.23Ohm SMD Solder Pad 7.98 X 5.44 X 3.
F2 = MF-MSMF050-2: PTC Resettable Fuse 0.5A_hold_ 1A_trip_ 15V 100A 0.8W 0.15s 0.15Ohm SMD Solder Pad 1812 T/R
G1 = HC0905A: Buzzer 5V 80mA h=5mm d=9.5mm 3200Hz
HL1 = LED_0_25_4
HL2 HL3 = LED_SMD: TO-1608BC-BF \  TO-1608BC-MRE
HL4 = LED_0_25_4: Светодиод желтый 25° d=3мм 1000мКд 589нМ (Yellow)
HL5 = LED_0_25_4: Светодиод зеленый 25° d=3мм 1200мКд 572нМ (Green)
HL6 = LED_0_25_4: Светодиод красный 20° d=3мм 200мКд 660нМ (Red)
J1 = BK-912-TR: Holder Coin Cell 20mm Smd
L1 = SRR1208-682KL: Fixed Inductors 330uH 10% SMD 1208; Manufacturer_Name: Bourns; Manufacturer_Part_Number: SRR1208-682KL; RS Part Number: *; RS Price/Stock: *; Arrow Part Number: SRR1208-682KL; Arrow Price/Stock: https://www.arrow.com/en/products/srr1208-682kl/bourns; Datasheet Link: http://www.bourns.com/data/global/pdfs/SRR1208.pdf
L2 = CM453232-471KL: BOURNS - CM453232-101KL - INDUCTOR, 4532 CASE, 100UH; Allied_Number: 70154277; Geometry.Height: 3.4mm; Manufacturer_Name: Bourns; Manufacturer_Part_Number: CM453232-471KL; RS Part Number: 6934353; RS Price/Stock: http://uk.rs-online.com/web/p/products/6934353; Allied Price/Stock: https://www.alliedelec.com/bourns-cm453232-471kl/70154277/; Arrow Part Number: CM453232-471KL; Arrow Price/Stock: https://www.arrow.com/en/products/cm453232-471kl/bourns; Datasheet Link: https://www.bourns.com/pdfs/cm.pdf
R1 R2 R5-R7 R10-R15 R17 R18 R20-R22 R29 R38 R39 R41 R44 R51 R53-R57 R59 R60 R62 R64 R66 R67 = R0603: SMD Res 0603
R3 R9 R16 R19 R23-R28 R30-R37 R40 R42 R43 R45-R50 R52 R58 R61 R63 R65 R69 R70 = R0805: SMD Res 0805
R4 = KNP2WS: Резисторы с проволочной обмоткой – сквозное отверстие 2.2ohm 2W 5%
R8 = R2512: SMD Res 2512
R68 = R1206: SMD Res 1206
S1 = 1437566-3: FSMSM=3.5X6 SMT TACT; Configuration_Pole-Throw: Single Pole - Single Throw; Contact_Current_Rating: 50 mA; MF: TE Connectivity; MP: 1437566-3; SnapEDA_Link: https://www.snapeda.com/parts/1437566-3/TE%20Connectivity/view-part/?ref=snap; Package: None; Availability: Unavailable; Price: None; Value: *
S2 = DM-08-V: SMD DIPSWITCH8
VD1 = SM15T39CA: TVS Diode Bi-Directional SM15T39CA 69.7V, 1500W, SMC 2-Pin
VD2 VD5 = SP0503BAHTG: SP050xBA Series 8 V 30 pF Uni-Directional SMT TVS Avalanche Diode Array SOT-143; MF: Littelfuse Inc.; Price: None; SnapEDA_Link: https://www.snapeda.com/parts/SP0503BAHTG/Littelfuse%20Inc./view-part/?ref=snap; Package: SOT-143 Littelfuse; Availability: Unavailable; MP: SP0503BAHTG; Value: *
VD3 = VS-30BQ040: VS-30BQ040-M3/9AT Vishay VS-30BQ040-M3/9AT, SMT Schottky Diode, 40V 4A, 2-Pin DO-214AB
VD4 = MBR130LSFT1G: Schottky Barrier Diodes, 1A to 2A, ON Semiconductor
VD6 = SS34: Rectifier, Schottky; DO-214AB; 3.0A IF; 0.75V; 40V; 100A IFRM; 10000V/us; 1000pF
VD7 = BAT54C: Small Signal Schottky Diode, Dual Common Cathode, 30 V, 200 mA, 400 mV, 600 mA, 125 C
VD8 = SP0504BAHT: TVS Diode-4
VT1 = MMBT3904.215: Транзистор NPN 40В 0.2А [SOT-23-3]
X1 = MSUB-05 (DS1104): Conn Mini USB 2.0 Type B RCP 5 POS 0.8mm Solder RA SMD 5 Terminal 1 Port Tray
X2 = 309-021-12: DG390-5.0-02P (XY118-2P-05) Зажимной Клеммник 2-контактный, 5.0мм угловой
X3 X6 = DS1021_1x2: Вилка штыревая 2.54мм 1x2 прямая тип1
X4 = microSD_500901-0801: TransFlash Memory Card,1.1mm hinge type TransFlash Memory Card,1.1mm hinge type
X8 = DS1021_2x3: Вилка штыревая 2.54мм 2x3 прямая тип1
X9 = DS1021_2x4: Вилка штыревая 2.54мм 2x4 прямая тип1
X10 = DS1021_1x4: Вилка штыревая 2.54мм 1x4 прямая тип1
X11 = B16B-PHDSS: HEADER, PHD, TOP, 16WAY, 2MM; Pitch Spacing:2mm; No. of Contacts:16Contacts;
X12 = RJ45 J0011D018: Conn RJ-45 F 8 POS 2.54mm Solder RA Thru-Hole 12 Terminal 1 Port Cat 5/Cat 6